# EAGLE design force_meter_RevB (EAGLE 7.2.0)
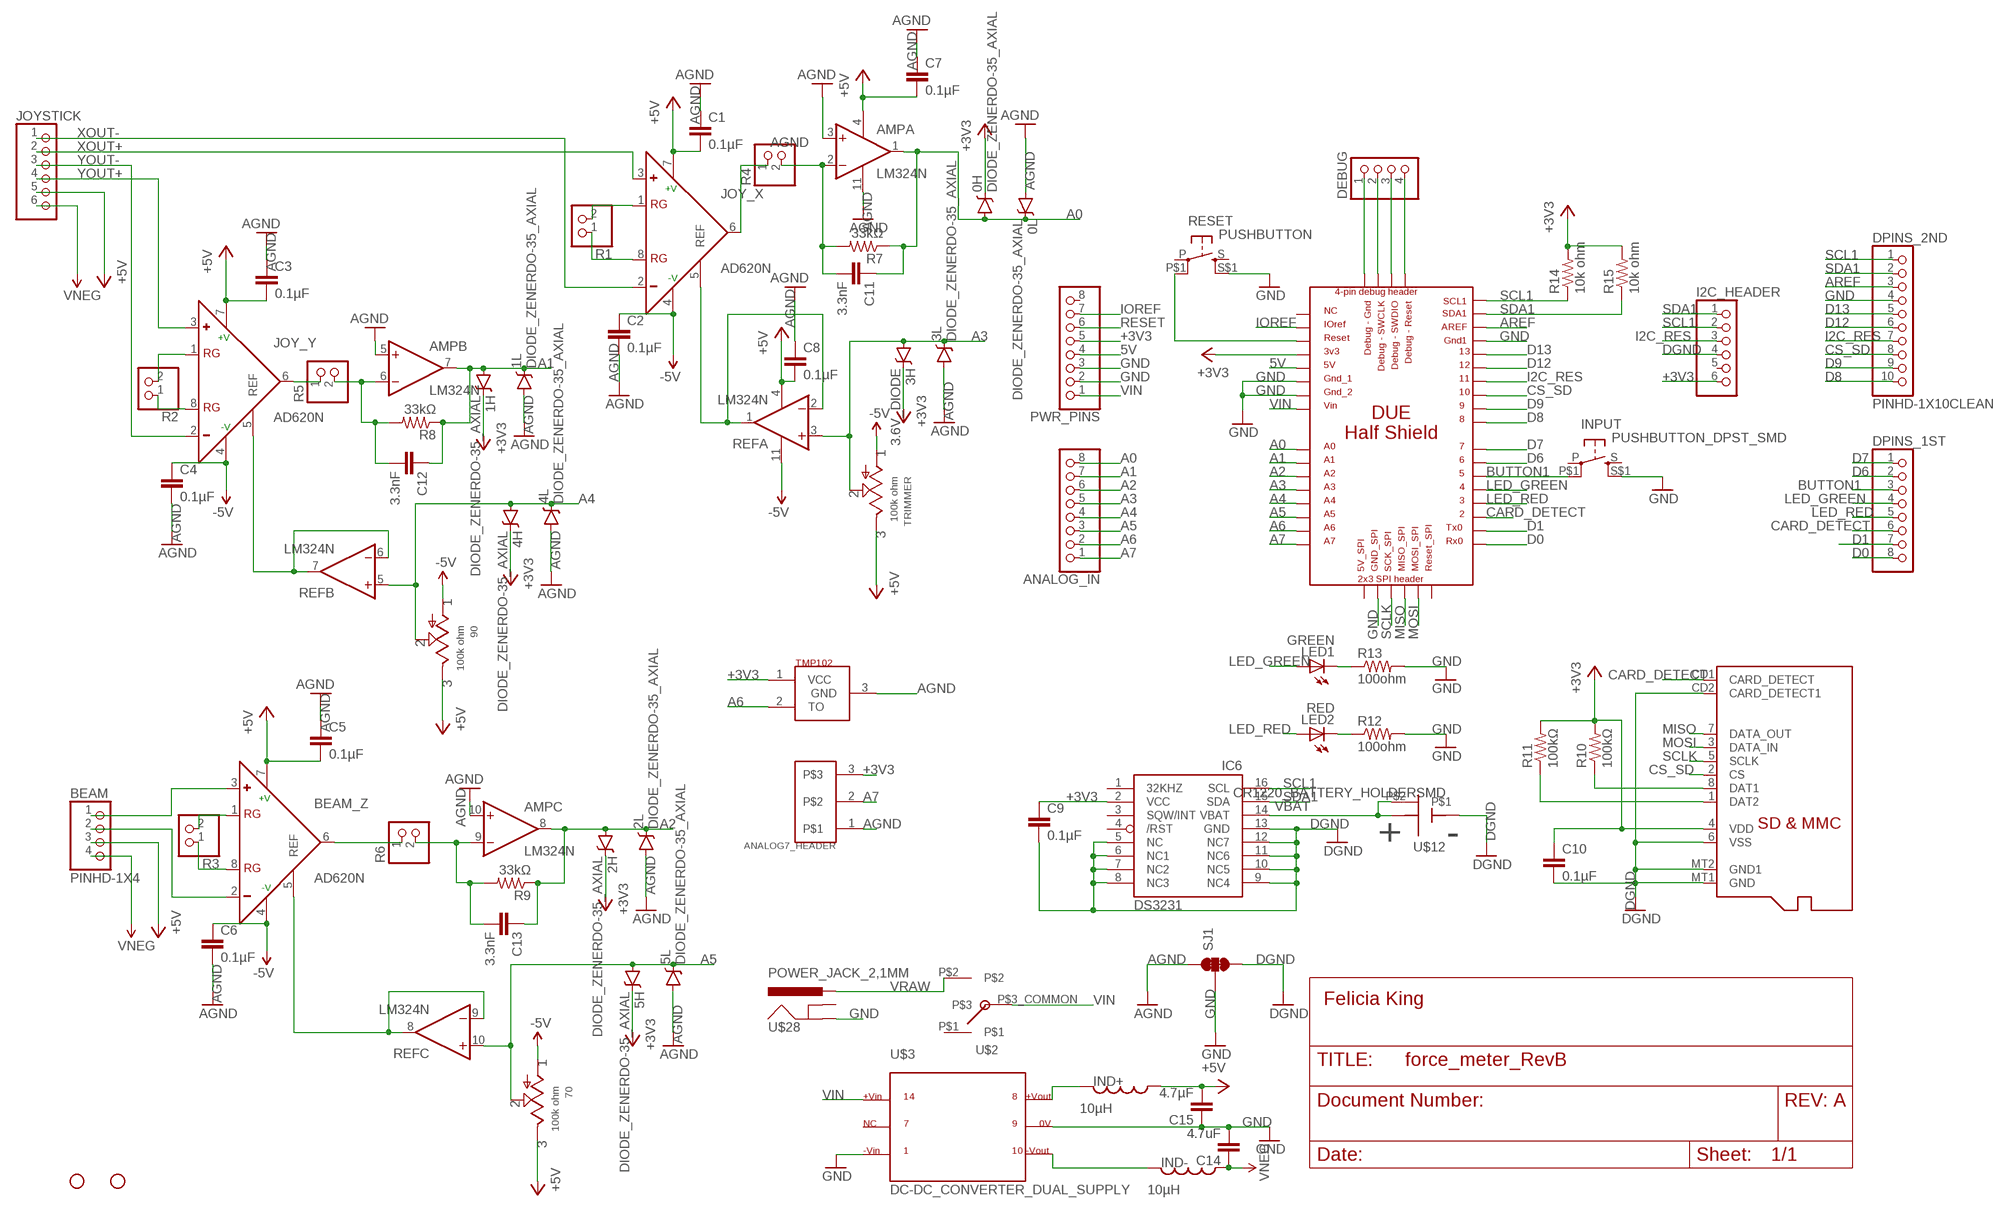
[diagram p0: schematic, sheet 1]

## Parts
0H  DIODE_ZENERDO-35_AXIAL  [DO35-7]
0L  DIODE_ZENERDO-35_AXIAL  [DO35-7]
1H  DIODE_ZENERDO-35_AXIAL  [DO35-7]
1L  DIODE_ZENERDO-35_AXIAL  [DO35-7]
2H  DIODE_ZENERDO-35_AXIAL  [DO35-7]
2L  DIODE_ZENERDO-35_AXIAL  [DO35-7]
3H  3.6V_DIODE  DIODE_ZENERDO-35_AXIAL  [DO35-7]
3L  DIODE_ZENERDO-35_AXIAL  [DO35-7]
4H  DIODE_ZENERDO-35_AXIAL  [DO35-7]
4L  DIODE_ZENERDO-35_AXIAL  [DO35-7]
5H  DIODE_ZENERDO-35_AXIAL  [DO35-7]
5L  DIODE_ZENERDO-35_AXIAL  [DO35-7]
70  100k ohm  TRIMMER_POTENTIOMETER_TT_ELEC67W  [R-TRIMMER_67W_TT_ELEC]
90  100k ohm  TRIMMER_POTENTIOMETER_TT_ELEC67W  [R-TRIMMER_67W_TT_ELEC]
AMP  LM324N  [DIL14]
ANALOG7_HEADER  PINHD-1X3  [1X03]
ANALOG_IN  PINHD-1X8CLEANBIG  [1X08-CLEANBIG]
BEAM  PINHD-1X4  PINHD-1X4LOCK  [1X04_LOCK]
BEAM_Z  AD620N  [DIL08]
C1  0.1µF  CAP0805  [0805]
C2  0.1µF  CAP0805  [0805]
C3  0.1µF  CAP0805  [0805]
C4  0.1µF  CAP0805  [0805]
C5  0.1µF  CAP0805  [0805]
C6  0.1µF  CAP0805  [0805]
C7  0.1µF  CAP0805  [0805]
C8  0.1µF  CAP0805  [0805]
C9  0.1µF  CAP0805  [0805]
C10  0.1µF  CAP0805  [0805]
C11  3.3nF  CAP0805  [0805]
C12  3.3nF  CAP0805  [0805]
C13  3.3nF  CAP0805  [0805]
C14  4.7uF  CAP0805  [0805]
C15  4.7µF  CAP0805  [0805]
DEBUG  PINHD-1X4LOCK  [1X04_LOCK]
DPINS_1ST  PINHD-1X8CLEANBIG  [1X08-CLEANBIG]
DPINS_2ND  PINHD-1X10CLEAN  [1X10-CLEANBIG]
I2C_HEADER  PINHD-1X6LOCK  [1X06-LOCK]
IC6  DS3231/SO  [SO16W]
IND+  10µH  INDUCTOR0805_TY  [I_0805]
IND-  10µH  INDUCTOR0805_TY  [I_0805]
INPUT  PUSHBUTTON_DPST_SMD  [PUSHBUTTON_DPST_SMD]
JOY_X  AD620N  [DIL08]
JOY_Y  AD620N  [DIL08]
JOYSTICK  PINHD-1X6LOCK  [1X06-LOCK]
LED1  GREEN  LED  [CHIPLED_0805]
LED2  RED  LED  [CHIPLED_0805]
PWR_PINS  PINHD-1X8CLEANBIG  [1X08-CLEANBIG]
R1  PINHD-1X2  [1X02]
R2  PINHD-1X2  [1X02]
R3  PINHD-1X2  [1X02]
R4  PINHD-1X2  [1X02]
R5  PINHD-1X2  [1X02]
R6  PINHD-1X2  [1X02]
R7  33kΩ  RESISTOR_SMDR0805  [R0805]
R8  33kΩ  RESISTOR_SMDR0805  [R0805]
R9  33kΩ  RESISTOR_SMDR0805  [R0805]
R10  100kΩ  RESISTOR_SMDR0805  [R0805]
R11  100kΩ  RESISTOR_SMDR0805  [R0805]
R12  100ohm  RESISTOR_SMDR0805  [R0805]
R13  100ohm  RESISTOR_SMDR0805  [R0805]
R14  10k ohm  RESISTOR_SMDR0805  [R0805]
R15  10k ohm  RESISTOR_SMDR0805  [R0805]
REF  LM324N  [DIL14]
RESET  PUSHBUTTON  PUSHBUTTON_DPST_SMD  [PUSHBUTTON_DPST_SMD]
SJ1  JUMPER-PAD-3-NC_BY_TRACE  [PAD-JUMPER-3-3OF3_NC_BY_TRACE_YES_SILK_FULL_BOX]
STANDOFF1  STAND-OFF  [STAND-OFF]
STANDOFF2  STAND-OFF  [STAND-OFF]
TMP102  LM62  [SOT23]
TRIMMER  100k ohm  TRIMMER_POTENTIOMETER_TT_ELEC67W  [R-TRIMMER_67W_TT_ELEC]
U$1  DUE_HALF_SHIELD_A7-ANALOG  [DUE_HALF_SHIELD_A7-ANALOG]
U$2  SWITCH_SLIDE_SMD_SPDT  [SWITCH_SMD_RA_SPDT]
U$3  DC-DC_CONVERTER_DUAL_SUPPLY  [DCDC_CONVERTOR-MEV1D]
U$11  MICROSD  [MICROSD]
U$12  CR1220_BATTERY_HOLDERSMD  [CR1220_BATTERY_HOLDER_SMD]
U$28  POWER_JACK_2,1MM  [POWER_JACK_DC_2,1MM]

## Nets
5V: PWR_PINS.4 U$1.5V1(5V)
+3V3: 0H.C 1H.C 2H.C 3H.C 4H.C 5H.C ANALOG7_HEADER.3 C9.1 C10.1 I2C_HEADER.6 IC6.2(VCC) PWR_PINS.5 R10.2 R11.2 R14.2 R15.2 TMP102.1(VCC) U$1.3V3 U$11.4(VDD)
+5V: 70.P$3 90.P$3 AMP.4(P:V+) BEAM.3 BEAM_Z.7(+V) C1.2 C3.2 C5.2 C7.2 C8.2 C15.2 IND+.P$1 JOY_X.7(+V) JOY_Y.7(+V) JOYSTICK.5 REF.4(P:V+) TRIMMER.P$3
-5V: 70.P$1 90.P$1 BEAM.4 BEAM_Z.4(-V) C6.1 C14.1 IND-.P$1 JOYSTICK.6 TRIMMER.P$1 ; supply symbol labelled VNEG
A0: 0H.A 0L.C AMP.1(A:OUT) ANALOG_IN.8 C11.1 R7.1 U$1.A0
A1: 1H.A 1L.C AMP.7(B:OUT) ANALOG_IN.7 C12.1 R8.1 U$1.A1
A2: 2H.A 2L.C AMP.8(C:OUT) ANALOG_IN.6 C13.1 R9.1 U$1.A2
A3: 3H.A 3L.C ANALOG_IN.5 REF.3(A:+IN) TRIMMER.P$2 U$1.A3
A4: 4H.A 4L.C 90.P$2 ANALOG_IN.4 REF.5(B:+IN) U$1.A4
A5: 5H.A 5L.C 70.P$2 ANALOG_IN.3 REF.10(C:+IN) U$1.A5
A6: ANALOG_IN.2 TMP102.2(TO) U$1.A6
A7: ANALOG7_HEADER.2 ANALOG_IN.1 U$1.A7
AGND: 0L.A 1L.A 2L.A 3L.A 4L.A 5L.A AMP.3(A:+IN) AMP.5(B:+IN) AMP.10(C:+IN) AMP.11(P:V-) ANALOG7_HEADER.1 C1.1 C2.2 C3.1 C4.2 C5.1 C6.2 C7.1 C8.1 SJ1.1 TMP102.3(GND)
AREF: DPINS_2ND.3 U$1.AREF
BUTTON1: DPINS_1ST.3 INPUT.P$1(P1) U$1.5
CARD_DETECT: DPINS_1ST.6 U$1.2 U$11.CD1(CARD_DETECT)
CS_SD: DPINS_2ND.8 U$1.10 U$11.2(CS)
D0: DPINS_1ST.8 U$1.RX0
D1: DPINS_1ST.7 U$1.TX0
D6: DPINS_1ST.2 U$1.6
D7: DPINS_1ST.1 U$1.7
D8: DPINS_2ND.10 U$1.8
D9: DPINS_2ND.9 U$1.9
D12: DPINS_2ND.6 U$1.12
D13: DPINS_2ND.5 U$1.13
DGND: C9.2 C10.2 I2C_HEADER.4 IC6.5(NC) IC6.6(NC1) IC6.7(NC2) IC6.8(NC3) IC6.9(NC4) IC6.10(NC5) IC6.11(NC6) IC6.12(NC7) IC6.13(GND) SJ1.3 U$11.6(VSS) U$11.CD2(CARD_DETECT1) U$11.MT1(GND) U$11.MT2(GND1) U$12.GND
GND: C14.2 C15.1 DPINS_2ND.4 INPUT.S$1(S1) PWR_PINS.2 PWR_PINS.3 R12.2 R13.2 RESET.S$1(S1) SJ1.2 U$1.GND1 U$1.GND_1 U$1.GND_2 U$1.GND_SPI U$3.P$1_-VIN U$3.P$9_0V U$28.P$2(GND)
I2C_RES: DPINS_2ND.7 I2C_HEADER.3 U$1.11
IOREF: PWR_PINS.7 U$1.IOREF1(IOREF)
LED_GREEN: DPINS_1ST.4 LED1.A U$1.4
LED_RED: DPINS_1ST.5 LED2.A U$1.3
MISO: U$1.MISO_SPI U$11.7(DATA_OUT)
MOSI: U$1.MOSI_SPI U$11.3(DATA_IN)
N$2: JOY_Y.1(RG) R2.2
N$3: JOY_X.6(OUT) R4.1
N$4: BEAM_Z.6(OUT) R6.1
N$5: JOY_X.1(RG) R1.2
N$6: JOY_X.8(RG) R1.1
N$7: JOY_Y.8(RG) R2.1
N$8: JOY_Y.6(OUT) R5.1
N$9: BEAM_Z.1(RG) R3.2
N$10: BEAM_Z.8(RG) R3.1
N$11: AMP.2(A:-IN) C11.2 R4.2 R7.2
N$21: AMP.6(B:-IN) C12.2 R5.2 R8.2
N$25: AMP.9(C:-IN) C13.2 R6.2 R9.2
N$28: IND-.P$2 U$3.P$10_-VOUT
N$29: IND+.P$2 U$3.P$8_VOUT
N$30: R10.1 U$11.8(DAT1)
N$31: BEAM.2 BEAM_Z.2(-)
N$32: BEAM.1 BEAM_Z.3(+)
N$33: R11.1 U$11.1(DAT2)
N$35: DEBUG.1 U$1.GND_DEBUG
N$36: LED1.C R13.1
N$37: LED2.C R12.1
N$38: DEBUG.2 U$1.SWCLK_DEBUG
N$39: DEBUG.3 U$1.SWDIO_DEBUG
N$40: DEBUG.4 U$1.RESET_DEBUG
REF_BEAM: BEAM_Z.5(REF) REF.8(C:OUT) REF.9(C:-IN)
REF_JOYX: JOY_Y.5(REF) REF.6(B:-IN) REF.7(B:OUT)
REF_JOYY: JOY_X.5(REF) REF.1(A:OUT) REF.2(A:-IN)
RESET: PWR_PINS.6 RESET.P$1(P1) U$1.RESET
SCL1: DPINS_2ND.1 I2C_HEADER.2 IC6.16(SCL) R14.1 U$1.SCL1
SCLK: U$1.SCK_SPI U$11.5(SCLK)
SDA1: DPINS_2ND.2 I2C_HEADER.1 IC6.15(SDA) R15.1 U$1.SDA1
VBAT: IC6.14(VBAT) U$12.P$1(VBAT) U$12.P$2
VIN: PWR_PINS.1 U$1.VIN1(VIN) U$2.P$3_COMMON U$3.P$14_VIN
VNEG: C2.1 C4.1 JOY_X.4(-V) JOY_Y.4(-V) REF.11(P:V-) ; supply symbol labelled -5V
VRAW: U$2.P$2 U$28.P$1(PWR)
XOUT+: JOY_X.3(+) JOYSTICK.2
XOUT-: JOY_X.2(-) JOYSTICK.1
YOUT+: JOY_Y.3(+) JOYSTICK.4
YOUT-: JOY_Y.2(-) JOYSTICK.3
Unconnected: AMP.12(D:+IN) AMP.13(D:-IN) AMP.14(D:OUT) I2C_HEADER.5 IC6.1(32KHZ) IC6.3(SQW/INT) IC6.4(/RST) INPUT.P INPUT.S PWR_PINS.8 REF.12(D:+IN) REF.13(D:-IN) REF.14(D:OUT) RESET.P RESET.S U$1.5V_SPI U$1.NC1(NC) U$1.RESET_SPI U$2.P$1 U$3.P$7_NC U$28.P$3(GNDBREAK)

## Library data of the parts
0H 0L 1H 1L 2H 2L 3H 3L 4H 4L 5H 5L = Felicia_force_logger:DIODE_ZENER: Zener Diode Example: NXP Semiconductors PN NZX3V6C,133 Digikey PN 568-7963-1-ND
70 90 = miller:TRIMMER_POTENTIOMETER_TT_ELEC: Trimmer potentiometer (variable resistor) TT Electronics Series 67 http://www.bitechnologies.com/pdfs/67.pdf
AMP REF = Felicia_force_logger:LM324: OP AMP LM324 quad op amp Digikey PN 296-1391-5-ND 14-PDIP
ANALOG7_HEADER = Felicia_force_logger:PINHD-1X3: 1x3 pin header, 0.1" spacing (2.54mm)
ANALOG_IN DPINS_1ST PWR_PINS = Felicia_force_logger:PINHD-1X8: PIN HEADER "BIG" packages have 0.04" drill holes and 0.07" pad widths Regular packages should have 0.035" drills with 0.066" pad widths.
BEAM DEBUG = Felicia_force_logger:PINHD-1X4: 1x4 0.1" space header Holes are slightly staggered to help hold pins in place when soldering.
BEAM_Z JOY_X JOY_Y = Felicia_force_logger:AD620: Low Cost, Low Power, Instrumentation Amplifier Source: http://www.analog.com/UploadedFiles/Data_Sheets/37793330023930AD620_e.pdf Digikey PN AD620ANZ-ND or similar 8-DIP Digikey PN AD620ARZ-ND 8-SOIC surface mount; MF: ALTERA CORPORATION; MPN: AD620AN; OC_FARNELL: 1523782; OC_NEWARK: 05F7108
C1-C15 = Felicia_force_logger:CAP: Capacitor Standard ceramic capacitor, surface mount or 0.1" leaded capacitor.
DPINS_2ND = Felicia_force_logger:PINHD-1X10: Pin header 1x10 0.1" spacing With round pins
I2C_HEADER JOYSTICK = Felicia_force_logger:PINHD-1X6: PIN HEADER "BIG" packages have 0.04" drills appropriate for larger terminal blocks, otherwise drills are 0.035".
IC6 = Felicia_force_logger:DS3231: DS3231 Real Time Clock, I2C. Temperature-compensated crystal oscillator 16SOIC-WIDE Digikey PN DS3231SN#T&RCT-ND
IND+ IND- = Felicia_force_logger:INDUCTOR: Inductor Example: Taiyo Yuden PN LBR2012T100K
INPUT RESET = Felicia_force_logger:PUSHBUTTON_DPST_SMD: PUSHBUTTON DPST SMD Omron B3S-1000 Digikey PN SW836CT-ND
LED1 LED2 = Felicia_force_logger:LED: LEDs Standard schematic elements and footprints for 5mm, 3mm, 1206, and 0603 sized LEDs. 5mm - Spark Fun Electronics SKU : COM-00529 (and others)
R1-R6 = Felicia_force_logger:PINHD-1X2: 1x2 pin header 0.1" spacing (2.54mm)
R7-R15 = Felicia_force_logger:RESISTOR_SMD: RESISTOR, American symbol
SJ1 = Felicia_force_logger:JUMPER-PAD-3-NC_BY_TRACE
STANDOFF1 STANDOFF2 = miller:STAND-OFF: #4 Stand Off This is the mechanical footprint for a #4 phillips button head screw. Use the keepout ring to avoid running the screw head into surrounding components. SKU : PRT-00447
TMP102 = Felicia_force_logger:LM62: LM62 Analog temperature sensor SOT-23 package 480mV offset at 0C, 15.6mV/C output 2.7 to 10V supply.
TRIMMER = Felicia_force_logger:TRIMMER_POTENTIOMETER_TT_ELEC: Trimmer potentiometer (variable resistor) TT Electronics Series 67 http://www.bitechnologies.com/pdfs/67.pdf
U$1 = Felicia_force_logger:DUE_HALF_SHIELD_A7-ANALOG: Arduino Due shield Matches Uno R3 footprint, but adds Due SPI 2x3 header, debug wire 4-pin header, and adds Analog pins A6 and A7. **NOTE**The 5V pin on the Due SPI 2x3 header outputs 5V, rather than the 3V3 you might expect.
U$2 = Felicia_force_logger:SWITCH_SLIDE_SMD_SPDT: Single Pole Dual Throw switch Copal PN CSS-1210TB (surface mount, right-angle) Digikey PN 563-1091-1-ND
U$3 = Felicia_force_logger:DC-DC_CONVERTER_DUAL_SUPPLY: Murata DC-DC converter dual-supply Example: Murata PN: MEV1D1205 Digikey PN: 811-2272-ND
U$11 = Felicia_force_logger:MICROSD: Micro-SD / Transflash card holder with SPI pinout For the 3M # 2908-05WB-MG and/or 4UCON #19656 push-push type Digikey PN 3M5607CT-ND
U$12 = Felicia_force_logger:CR1220_BATTERY_HOLDER: CR1220 Battery Holder Keystone Part # 3001 Digikey 3001K-ND
U$28 = Felicia_force_logger:POWER_JACK_2,1MM: DC Power Jack, 2.1mm center pin. Digikey PN CP-202AH-ND

## Board
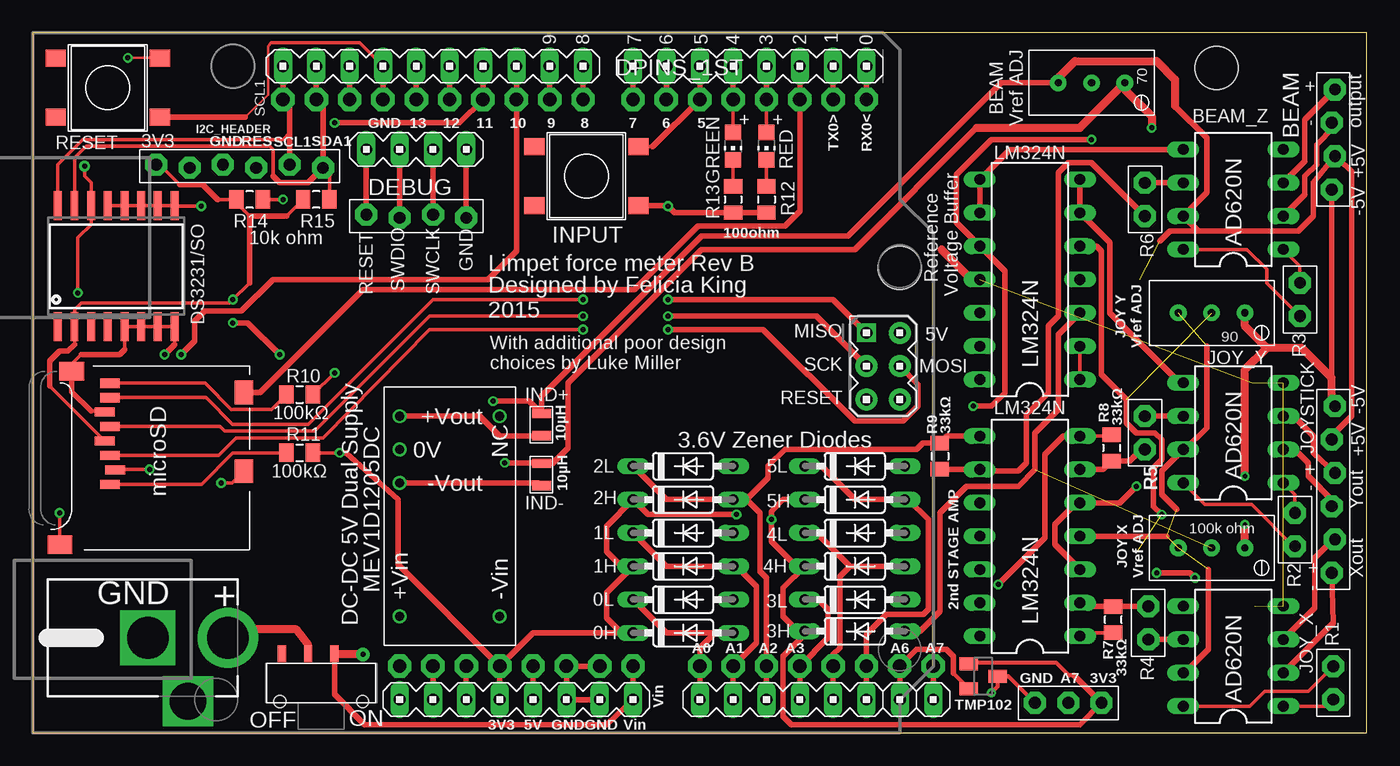
[diagram p1: board, top side]
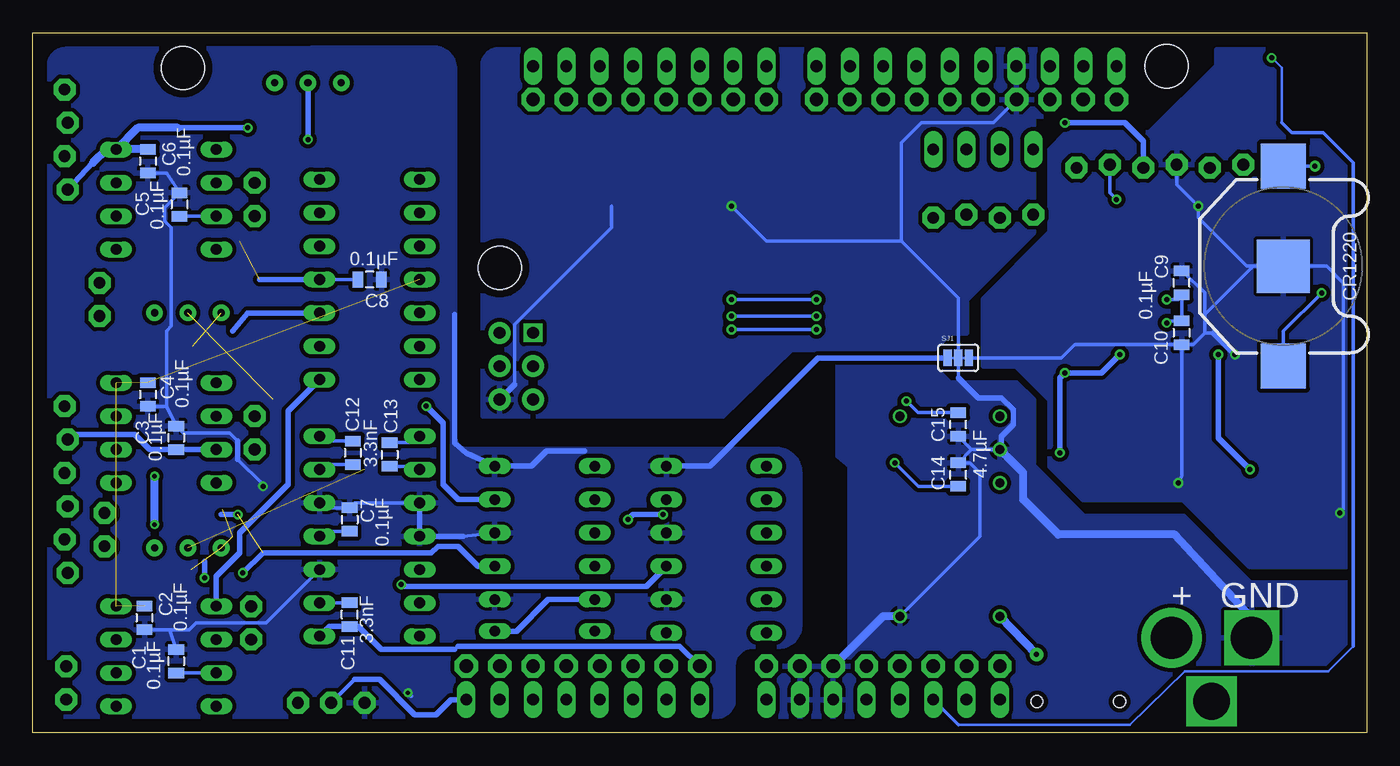
[diagram p2: board, bottom side, seen from below]

Size 101.6 x 53.34 mm. Coordinates in mm from the lower left corner, seen from the top.
Outline: 0,0 101.6,0 101.6,53.34 0,53.34 0,0
Copper layers (1*16): Top 0.0356mm / dielectric 1.5011mm / Bottom 0.0356mm
Design rules "LaenPCBOrder *": minimum track width 6mil, minimum drill 13mil, track to track 6mil, track to pad 6mil, pad to pad 6mil, via to via 6mil, smd to smd 6mil, copper to edge 15mil, drill to drill 6mil, minimum pad ring 7mil, minimum via ring 7mil, stop-mask expansion 3mil, vias tented up to drill 30mil, thermal gap 10mil

### Footprints (pad centres in the part's own frame; a part is rotated, then mirrored left to right if it is on the bottom)
DO35-7 = drill 0.813 long: A 3.81,0; C -3.81,0
R-TRIMMER_67W_TT_ELEC = drill 0.541 pad 1.27: P$1 -2.54,0; P$2 0,0; P$3 2.54,0
DIL14 = drill 0.813 long: 1 -7.62,-3.81; 2 -5.08,-3.81; 3 -2.54,-3.81; 4 0,-3.81; 5 2.54,-3.81; 6 5.08,-3.81; 7 7.62,-3.81; 8 7.62,3.81; 9 5.08,3.81; 10 2.54,3.81; 11 0,3.81; 12 -2.54,3.81; 13 -5.08,3.81; 14 -7.62,3.81
1X03 = drill 0.9 pad 1.676 octagon: 1 -2.54,0; 2 0,0; 3 2.54,0
1X08-CLEANBIG = drill 1.016 pad 1.778 octagon: 1 -8.89,0; 2 -6.35,0; 3 -3.81,0; 4 -1.27,0; 5 1.27,0; 6 3.81,0; 7 6.35,0; 8 8.89,0
1X04_LOCK = drill 0.9 pad 1.676 octagon: 1 -3.81,0.127; 2 -1.27,-0.127; 3 1.27,0.127; 4 3.81,-0.127
DIL08 = drill 0.813 long: 1 -3.81,-3.81; 2 -1.27,-3.81; 3 1.27,-3.81; 4 3.81,-3.81; 5 3.81,3.81; 6 1.27,3.81; 7 -1.27,3.81; 8 -3.81,3.81
0805 = smd 0.8 x 1.2: 1 -0.9,0; 2 0.9,0
1X10-CLEANBIG = drill 1.016 pad 1.778 octagon: 1 -11.43,0; 2 -8.89,0; 3 -6.35,0; 4 -3.81,0; 5 -1.27,0; 6 1.27,0; 7 3.81,0; 8 6.35,0; 9 8.89,0; 10 11.43,0
1X06-LOCK = drill 0.9 pad 1.676 octagon: 1 -6.35,0.127; 2 -3.81,-0.127; 3 -1.27,0.127; 4 1.27,-0.127; 5 3.81,0.127; 6 6.35,-0.127
SO16W = smd 0.6 x 2.2: 1 -4.445,-4.6; 2 -3.175,-4.6; 3 -1.905,-4.6; 4 -0.635,-4.6; 5 0.635,-4.6; 6 1.905,-4.6; 7 3.175,-4.6; 8 4.445,-4.6; 9 4.445,4.6; 10 3.175,4.6; 11 1.905,4.6; 12 0.635,4.6; 13 -0.635,4.6; 14 -1.905,4.6; 15 -3.175,4.6; 16 -4.445,4.6
I_0805 = smd 0.7 x 1.45: P$1 -0.85,0; P$2 0.85,0
PUSHBUTTON_DPST_SMD = smd 1.55 x 1.3: P 3.975,-2.25; P$1 -3.975,-2.25; S 3.975,2.25; S$1 -3.975,2.25
CHIPLED_0805 = smd 1.2 x 1.2: A 0,-1.05; C 0,1.05
1X02 = drill 0.9 pad 1.676 octagon: 1 -1.27,0; 2 1.27,0
R0805 = smd 1.1 x 1.4: 1 -1,0; 2 1,0
PAD-JUMPER-3-3OF3_NC_BY_TRACE_YES_SILK_FULL_BOX = smd 0.635 x 1.27: 1 -0.813,0; 2 0,0; 3 0.813,0
STAND-OFF = hole 3.302: 0,0
SOT23 = smd 1 x 1.4: 1 -0.95,-1.1; 2 0.95,-1.1; 3 0,1.1
DUE_HALF_SHIELD_A7-ANALOG = drill 0.9 pad 1.422 long: 2 58.42,50.8; 3 55.88,50.8; 3V3 35.56,2.54; 4 53.34,50.8; 5 50.8,50.8; 5V1 38.1,2.54; 6 48.26,50.8; 7 45.72,50.8; 8 41.91,50.8; 9 39.37,50.8; 10 36.83,50.8; 11 34.29,50.8; 12 31.75,50.8; 13 29.21,50.8; A0 50.8,2.54; A1 53.34,2.54; A2 55.88,2.54; A3 58.42,2.54; A4 60.96,2.54; A5 63.5,2.54; A6 66.04,2.54; A7 68.58,2.54; AREF 24.13,50.8; GND1 26.67,50.8; GND_1 40.64,2.54; GND_2 43.18,2.54; GND_DEBUG 33.02,44.45; IOREF1 30.48,2.54; NC1 27.94,2.54; RESET 33.02,2.54; RESET_DEBUG 25.4,44.45; RX0 63.5,50.8; SCL1 19.05,50.8; SDA1 21.59,50.8; SWCLK_DEBUG 30.48,44.45; SWDIO_DEBUG 27.94,44.45; TX0 60.96,50.8; VIN1 45.72,2.54 | drill 0.9 pad 1.676: 5V_SPI 66.04,30.48; GND_SPI 66.04,25.4; MOSI_SPI 66.04,27.94; RESET_SPI 63.5,25.4; SCK_SPI 63.5,27.94 | drill 0.9 pad 1.422 square: MISO_SPI 63.5,30.48
SWITCH_SMD_RA_SPDT = smd 0.635 x 1.27: P$1 -3,3.75; P$2 -1,3.75; P$3_COMMON 1,3.75 | hole 0.9: -3.15,0.1; 3.15,0.1
DCDC_CONVERTOR-MEV1D = drill 0.7: P$1_-VIN -7.62,-3.81; P$7_NC 7.62,-3.81; P$8_VOUT 7.62,3.81; P$9_0V 5.08,3.81; P$10_-VOUT 2.54,3.81; P$14_VIN -7.62,3.81
MICROSD = smd 0.7 x 1.5: 1 9,-10.64; 2 7.9,-10.24; 3 6.8,-10.64; 4 5.7,-11.04; 5 4.6,-10.64; 6 3.5,-11.04; 7 2.4,-10.64; 8 1.3,-10.64 | smd 1.8 x 1.4: CD1 2,-0.44; CD2 8,-0.44 | smd 1.4 x 1.9: MT1 0.4,-13.54; MT2 13.6,-14.44
CR1220_BATTERY_HOLDER_SMD = smd 4.064 x 4.064: GND 0,0 | smd 3.429 x 3.429: P$1 -7.62,0; P$2 7.62,0
POWER_JACK_DC_2,1MM = drill 3.175 pad 4.572: P$1 0,0 | drill 3.175 square: P$2 6.096,0 | drill 2.8 square: P$3 3.048,4.826

### Placement (x,y rotation side)
0H  49.53,7.62 0 top
0L  49.53,10.16 0 top
1H  49.53,12.7 0 top
1L  49.53,15.24 0 top
2H  49.53,17.78 0 top
2L  49.53,20.32 0 top
3H  62.61,7.75 0 top
3L  62.61,10.16 0 top
4H  62.61,12.7 0 top
4L  62.61,15.24 0 top
5H  62.61,17.78 0 top
5L  62.61,20.32 0 top
70  80.64,49.53 180 top
90  89.79,32 180 top
AMP  75.95,14.99 90 top
ANALOG7_HEADER  78.87,2.29 0 top
ANALOG_IN  59.69,5.08 180 top
BEAM  99.06,45.21 270 top
BEAM_Z  91.44,40.64 90 top
C1  90.68,5.46 270 bottom
C2  93.09,8.76 270 bottom
C3  90.68,22.48 270 bottom
C4  92.84,25.78 270 bottom
C5  90.42,40.26 270 bottom
C6  92.84,43.56 270 bottom
C7  77.47,16.26 270 bottom
C8  75.95,34.54 180 bottom
C9  14.1,34.29 90 bottom
C10  14.1,30.48 270 bottom
C11  77.47,9.02 90 bottom
C12  77.22,21.34 270 bottom
C13  74.42,21.21 270 bottom
C14  31.11,19.68 90 bottom
C15  31.11,23.5 90 bottom
DEBUG  29.21,39.37 180 top
DPINS_1ST  54.61,48.26 0 top
DPINS_2ND  30.48,48.26 0 top
I2C_HEADER  15.75,43.18 180 top
IC6  6.35,35.56 0 top
IND+  38.73,23.5 270 top
IND-  38.73,19.68 270 top
INPUT  42.16,42.42 180 top
JOY_X  91.44,5.84 90 top
JOY_Y  91.44,22.86 90 top
JOYSTICK  99.06,18.54 90 top
LED1  53.34,44.7 180 top
LED2  55.88,44.7 180 top
PWR_PINS  36.83,5.08 180 top
R1  99.06,3.81 270 top
R2  96.14,15.49 90 top
R3  96.52,33.02 90 top
R4  84.96,8.38 90 top
R5  84.71,22.86 270 top
R6  84.71,40.64 270 top
R7  82.3,8.64 90 top
R8  82.17,21.72 270 top
R9  69.09,21.08 270 top
R10  20.32,25.78 0 top
R11  20.32,21.34 0 top
R12  55.88,40.64 270 top
R13  53.34,40.64 270 top
R14  16.51,40.64 180 top
R15  21.59,40.64 180 top
REF  75.95,34.54 90 top
RESET  5.71,49.15 180 top
SJ1  31.11,28.57 0 bottom
STANDOFF1  15.24,50.8 0 top
STANDOFF2  66.04,35.43 0 top
STANDOFF3  STAND-OFF  [STAND-OFF]  90.17,50.67 0 top
TMP102  72.39,4.32 270 top
TRIMMER  89.79,14.1 180 top
U$1  0,0 0 top
U$2  21.97,2.29 0 top
U$3  31.75,16.51 90 top
U$11  16.51,27.94 270 top
U$12  6.35,35.56 270 bottom
U$28  14.86,7.24 180 top

### Tracks (layer width: path | path; a pad name or v marks a point on that pad's centre or on a via)
5V
  Top 0.406: U$1.5V1 PWR_PINS.4
+3V3  (via drill 0.38, 0.38 pad 0.3)
  Top 0.254: R15.2 19.32,39.37 | 16.51,39.37 15.51,40.37 R14.2 14.1,40.64 | 16.51,34.29 v15.24,33.02 14.99,32.77 3.68,32.77 3.17,32.26 IC6.2 3.17,29.59 | 1.27,26.44 U$11.4 | v56.26,16.26 56.26,16.38 | R11.2 v23.37,21.34 | v22.99,27.43 R10.2 | I2C_HEADER.6 9.65,43.31 11.18,41.78
  Top 0.305: 79.31,4.38 78.93,4.38 77.98,5.33 71.36,5.33 TMP102.1
  Top 0.406: U$1.3V3 PWR_PINS.5 | 19.32,39.37 16.51,39.37 16.51,34.29 | 3.17,29.59 2.67,29.08 2.03,29.08 1.27,28.32 1.27,26.44 | PWR_PINS.5 38.1,7.62 0H.C 44.83,7.62 43.69,8.76 43.69,10.67 1H.C 44.83,12.7 43.69,13.84 43.69,15.75 2H.C 46.86,16.64 v53.59,16.64 | v23.37,21.34 23.88,21.34 27.81,17.78 27.81,12.83 PWR_PINS.5 | v15.24,31.24 16.38,31.24 v18.8,28.83 | 11.18,41.78 12.95,41.78 14.1,40.64 | 79.31,4.38 ANALOG7_HEADER.3 79.76,0.64 57.78,0.64 57.15,1.27 57.15,5.84 58.93,7.62 3H.C 58.29,7.75 57.15,8.89 57.15,11.05 4H.C 58.17,12.7 56.26,14.61 v56.26,16.26 | 56.26,16.38 56.26,16.89 57.15,17.78 5H.C
  Bottom 0.254: v15.24,33.02 14.34,33.02 C9.1 C10.1 15.1,31.38 v15.24,31.24
  Bottom 0.406: v53.59,16.64 55.88,16.64 v56.26,16.26 | v23.37,21.34 23.37,27.05 v22.99,27.43 20.19,27.43 v18.8,28.83
+5V  (via drill 0.38 pad 0.3)  (5 unrouted)
  Top 0.254: JOY_Y.7 87.76,21.59 | JOYSTICK.5 99.06,22.73
  Top 0.406: v35.05,25.27 37.81,25.27 IND+.P$1 38.73,25.65 50.93,37.85 62.1,37.85 73.79,49.53 70.P$3 | 88.77,38.23 96.39,38.23 97.54,39.37 97.54,41.91 BEAM.3 100.46,42.8 100.46,24.13 99.06,22.73 | 88.77,38.23 BEAM_Z.7 89.41,41.15 89.41,45.34 87,47.75 | 88.77,38.23 86.61,38.23 85.85,37.47 | 87.76,21.59 89.41,23.24 89.41,29.46 | JOY_X.7 87.76,4.57 89.53,6.35 89.53,12.45 | 87.12,17.02 85.98,18.16 85.98,19.94 JOY_Y.7 | AMP.4 86.36,14.99
  Top 0.61: 70.P$3 78.11,49.91 79.38,51.18 85.6,51.18 87,49.78 87,47.75
  Bottom 0.254: C15.2 34.17,24.39 v35.05,25.27 | C1.2 87.64,4.56 JOY_X.7 | 89.91,21.59 C3.2 | BEAM_Z.7 89.91,39.37 C5.2 | C7.2 79.39,15.36 AMP.4 | REF.4 C8.2
  Bottom 0.406: JOY_Y.7 89.91,21.59 | C3.2 92.7,21.58 93.85,22.73 98.68,22.73 JOYSTICK.5 | REF.4 84.33,34.54
-5V  (via drill 0.33, 0.38, 0.38 pad 0.3)
  Top 0.254: 38.7,20.57 IND-.P$1 39.59,20.54
  Top 0.406: v35.94,20.57 38.7,20.57 | 39.59,20.54 40.77,21.72 40.77,26.67 50.93,36.83 62.61,36.83 71.88,46.1 | BEAM.4 98.93,25.15 JOYSTICK.6
  Top 0.61: 71.88,46.1 79.76,46.1 70.P$1 83.19,49.02 85.22,46.99 v85.22,46.1 | 98.93,25.15 98.93,27.05 96.65,29.34 93.98,29.34 | 93.98,29.34 92.33,30.99 90.P$1 | TRIMMER.P$1 v92.33,15.88 | v92.33,19.56 92.33,27.69 93.98,29.34
  Bottom 0.254: C14.1 34.15,18.79 v35.94,20.57
  Bottom 0.406: 97.03,43.43 BEAM.4 | v85.22,46.1 90.55,46.1
  Bottom 0.61: 90.55,46.1 93.6,46.1 BEAM_Z.4 | C6.1 BEAM_Z.4 | BEAM_Z.4 96.01,44.45 97.03,43.43 | v92.33,15.88 v92.33,19.56
A0
  Top 0.254: R7.1 80.03,7.64 AMP.1
  Top 0.406: U$1.A0 ANALOG_IN.8 50.8,6.48 51.94,7.62 | 0H.A 51.94,7.62 | 51.94,7.62 48.26,7.62 0L.C
  Bottom 0.254: C11.1 76.82,8.12 | 69.47,6.35 69.22,6.6
  Bottom 0.406: C11.1 79,8.12 AMP.1 | 76.82,8.12 75.06,6.35 69.47,6.35 | 69.22,6.6 52.32,6.6 ANALOG_IN.8
A1  (via drill 0.38)
  Top 0.254: AMP.7 82.06,22.61 R8.1
  Top 0.406: U$1.A1 ANALOG_IN.7 55.12,6.86 55.12,11.18 53.59,12.7 1H.A | 1H.A 48.26,12.7 1L.C | AMP.7 78.49,22.61 77.09,21.21 77.09,14.86 v73.53,11.3 | 52.07,12.7 1H.A
  Bottom 0.203: 73.41,11.18 v73.53,11.3
  Bottom 0.254: C12.1 79.39,22.24 AMP.7
  Bottom 0.406: 73.41,11.18 54.86,11.18 1H.A
A2
  Top 0.406: U$1.A2 ANALOG_IN.6 | ANALOG_IN.6 55.88,6.22 | 54.36,17.78 55.37,16.76 55.37,12.32 55.88,11.81 ANALOG_IN.6 | 54.36,17.78 2H.A 48.26,17.78 2L.C | 54.36,17.78 56.01,19.43 56.01,20.32 57.28,21.59 67.31,21.59 67.8,22.08 R9.1 69.61,22.61 AMP.8
  Bottom 0.254: C13.1 72.63,22.11 AMP.8
A3  (1 unrouted)
  Top 0.406: U$1.A3 ANALOG_IN.5 60.58,7.24 60.58,9.4 59.82,10.16 3L.C | REF.3 78.11,30.35 78.11,24.64 76.33,22.86 76.33,20.07 75.06,18.8 71.12,18.8 69.09,16.76 69.09,9.27 67.56,7.75 3H.A
  Bottom 0.406: REF.3 85.22,32 86.36,30.61 | 3L.C 62.36,10.16 64.77,7.75 3H.A
A4  (via drill 0.38)  (2 unrouted)
  Top 0.406: U$1.A4 ANALOG_IN.4 60.96,5.97 61.47,6.48 61.47,11.94 62.23,12.7 | v85.6,12.19 88.14,12.19 v88.52,11.81 | REF.5 81.03,37.08 81.41,36.7 81.41,27.3 83.31,25.4 83.31,23.62 84.07,22.86 85.47,22.86 85.98,22.35 85.98,20.83 85.34,20.19 85.34,17.27 v85.98,16.64 | 4L.C 59.69,15.24 62.23,12.7 | 62.23,12.7 4H.A
  Bottom 0.406: v85.6,12.19 84.07,13.72 71.25,13.72 70.74,14.22 69.22,14.22 67.69,12.7 4H.A | v88.52,11.81 88.52,13.08 | v85.98,16.64 87.25,16.64
A5  (via drill 0.38)
  Top 0.254: REF.10 72.14,36.7
  Top 0.406: U$1.A5 ANALOG_IN.3 63.5,7.49 65.02,9.02 67.82,9.02 68.2,9.4 68.2,16.26 66.67,17.78 5H.A 62.61,17.78 60.07,20.32 5L.C | v80.64,45.21 73.03,45.21 70.36,42.55 70.36,38.86 REF.10 74.04,35.18 74.04,25.91 73.03,24.89 v71.63,24.89
  Bottom 0.406: v80.64,45.21 70.P$2 | 5H.A 69.22,17.78 70.36,18.92 70.36,23.62 v71.63,24.89
A6
  Top 0.305: 70.1,4.55 TMP102.2
  Top 0.406: U$1.A6 ANALOG_IN.2 67.31,6.35 69.6,6.35 70.1,5.84 70.1,4.55
A7
  Top 0.406: U$1.A7 ANALOG_IN.1
  Bottom 0.305: 77.09,4.06 ANALOG7_HEADER.2
  Bottom 0.406: U$1.A7 69.72,2.54 70.87,1.4 72.52,1.4 75.18,4.06 77.09,4.06
AGND  (via drill 0.33 pad 0.69, 0.38)
  Top 0.254: AMP.5 79.5,17.53
  Top 0.305: ANALOG7_HEADER.1 74.3,4.32 TMP102.3 73.49,3.51 v73.03,3.05
  Top 0.406: 79.5,17.53 77.85,15.88 77.85,14.35 AMP.3 | AMP.5 82.8,17.53 v84.07,18.8
  Bottom 0.254: C2.2 91.16,7.86 | 91.16,7.86 C1.1 | C4.2 91.42,24.88 | 91.42,24.88 C3.1 90.16,22.86 86.61,22.86 85.98,22.23 | C6.2 91.42,42.66 C5.1 91.57,40.02 91.57,38.99 91.06,38.48 91.06,30.99 91.42,30.63 91.42,24.88 | AMP.5 79.39,17.16 C7.1 77.1,17.53 AMP.10 | 91.16,7.86 89.67,7.86 89.15,8.38 83.82,8.38 AMP.3 | 68.83,14.99 4L.A | v84.07,18.8 84.07,18.92 85.98,20.83
  Bottom 0.305: v73.03,3.05 72.77,2.79
  Bottom 0.406: 59.56,21.46 62.48,21.46 63.63,20.32 5L.A 68.58,21.34 69.47,22.1 69.47,31.88 | AMP.10 AMP.11 68.83,14.99 | 85.98,20.83 85.98,22.23 | 2L.A 50.04,20.32 41.78,28.57 SJ1.1
  pour Bottom (isolate 0.305): 69.47,22.48 69.47,50.53 arc-90 71.13,52.19 99.07,52.08 arc-90 100.33,50.81 100.33,2.54 arc-90 99.06,1.27 49.53,1.27 arc-90 48.26,2.54 48.26,5.08 arc90 46.86,6.6 44.85,6.6 arc-90 43.18,8.15 43.18,19.79 arc-90 44.98,21.59 68.58,21.59 arc90
AREF
  Top 0.406: U$1.AREF DPINS_2ND.3
BUTTON1
  Top 0.254: 50.71,48.17 DPINS_1ST.3 | INPUT.P$1 47.21,44.67
  Top 0.406: U$1.5 DPINS_1ST.3 47.21,44.67
CARD_DETECT
  Top 0.406: U$1.2 DPINS_1ST.6 58.42,39.75 57.28,38.61 50.67,38.61 45.85,33.78 25.15,33.78 17.3,25.94 U$11.CD1
CS_SD  (via drill 0.38)
  Top 0.254: v8.89,20.07 6.3,20.07 U$11.2
  Top 0.406: U$1.10 DPINS_2ND.8 36.83,36.7 34.67,34.54 18.29,34.54 15.88,32.13 13.08,32.13 12.32,31.37 12.32,29.84 v11.3,28.83
  Bottom 0.406: v11.3,28.83 11.3,22.48 v8.89,20.07
D0
  Top 0.406: U$1.RX0 DPINS_1ST.8
D1
  Top 0.406: U$1.TX0 DPINS_1ST.7
D6
  Top 0.406: U$1.6 DPINS_1ST.2
D7
  Top 0.406: U$1.7 DPINS_1ST.1
D8
  Top 0.406: U$1.8 DPINS_2ND.10
D9
  Top 0.406: U$1.9 DPINS_2ND.9
D12
  Top 0.406: U$1.12 DPINS_2ND.6
D13
  Top 0.406: U$1.13 DPINS_2ND.5
DGND  (via drill 0.38)
  Top 0.254: IC6.13 IC6.12 IC6.11 IC6.10 IC6.9 10.82,40.13 v12.83,40.13 | U$11.MT1 2.97,28.12 3.68,28.83 | 6.99,29.21 IC6.5 IC6.6 IC6.7 IC6.8 10.79,29.59 | 4.45,24.51 5.4,24.51 U$11.6 | v14.35,19.05 15.18,19.05 U$11.CD2 | v2.03,16.76 2.03,14.38 U$11.MT2
  Top 0.406: 3.68,28.83 6.6,28.83 6.99,29.21 | U$11.MT1 2.97,25.99 4.45,24.51 | 10.79,29.59 v10.03,28.83
  Bottom 0.254: C10.2 13.22,29.58 12.32,30.48 | 12.32,30.48 12.32,31.88 | 12.32,31.88 8.64,35.56 | 8.64,35.56 U$12.GND 3.05,35.56 1.78,34.29 1.78,17.02 v2.03,16.76 | 12.32,31.88 12.32,33.54 C9.2 | SJ1.3 23.24,28.57 22.23,29.59 13.98,29.59 C10.2 | C10.2 14.1,19.56 v14.35,19.05 | I2C_HEADER.4 14.48,41.78 v12.83,40.13 12.83,39.24 9.14,35.56 8.64,35.56 | 11.68,30.48 12.32,30.48
  Bottom 0.406: v10.03,28.83 11.68,30.48
  pour Bottom (isolate 0.305): 1.27,12.7 8.89,12.7 13.97,17.78 21.59,17.78 24.13,20.32 24.13,25.4 26.67,27.94 29.21,27.94 29.21,33.02 24.13,38.1 24.13,44.45 22.86,45.72 16.51,45.72 11.43,50.8 11.43,52.07 1.27,52.07
GND  (via drill 0.38)
  Top 0.203: 16.16,46.9 17.91,48.64 17.91,52.32 18.16,52.58
  Top 0.254: 18.16,52.58 24.89,52.58 U$1.GND1 | 55.9,39.62 R12.2 | 48.35,40.17 v48.39,40.13
  Top 0.406: U$1.GND_2 U$1.GND_1 PWR_PINS.3 PWR_PINS.2 | U$1.GND1 DPINS_2ND.4 | R12.2 R13.2 48.88,39.64 v48.39,40.13 | INPUT.S$1 48.35,40.17 | RESET.S$1 16.16,46.9
  Bottom 0.203: 27.82,21.71 U$3.P$9_0V
  Bottom 0.254: U$3.P$9_0V 30.11,21.59 | 30.11,21.59 C15.1 | 30.11,21.59 C14.2 30.24,20.59 29.46,19.81 29.46,14.99 U$3.P$1_-VIN | 35.43,37.47 31.11,33.15 SJ1.2 31.11,27.05 | 35.43,37.47 35.43,44.96 33.91,46.48 28.45,46.48 DPINS_2ND.4 | 35.43,37.47 45.72,37.47 v48.39,40.13 | 64.9,26.54 64.9,31.11 57.53,38.48 57.53,40.13
  Bottom 0.406: U$1.GND_SPI 64.9,26.54 | 31.11,27.05 29.59,25.53 27.81,25.53 26.92,24.64 26.92,23.5 27.82,22.59 27.82,21.71
  Bottom 0.61: U$3.P$1_-VIN 36.83,8.89 PWR_PINS.3 | 8.76,8.76 14.61,15.11 23.5,15.11 26.16,17.78 26.16,19.81 U$3.P$9_0V
  Bottom 0.813: U$28.P$2 8.76,8.76
  pour Bottom (isolate 0.305): 1.27,11.43 1.27,1.27 46.99,1.27 46.99,5.08 40.64,5.08 39.37,6.35 39.37,20.32 40.26,21.08 40.26,27.94 33.02,27.94 31.75,26.67 26.67,26.67 25.4,25.4 25.4,20.32 21.59,16.51 13.97,16.51 8.89,11.43
  pour Bottom (isolate 0.305): 17.78,52.07 17.78,46.99 25.4,46.99 25.4,38.1 30.48,33.02 30.48,30.48 31.75,30.48 33.02,29.21 43.81,29.21 49.02,24.13 67.31,24.13 67.31,50.8 arc90 66.04,52.07
I2C_RES  (via drill 0.38)
  Top 0.406: U$1.11 DPINS_2ND.7 32.51,46.48 v22.99,46.48
  Bottom 0.406: I2C_HEADER.3 17.02,45.09 18.41,46.48 v22.99,46.48
IOREF
  Top 0.406: U$1.IOREF1 PWR_PINS.7
LED_GREEN
  Top 0.254: LED1.A DPINS_1ST.4
  Top 0.406: U$1.4 DPINS_1ST.4
LED_RED
  Top 0.254: LED2.A DPINS_1ST.5
  Top 0.406: U$1.3 DPINS_1ST.5
MISO  (via drill 0.38)
  Top 0.254: v41.91,33.02 30.48,33.02 20.95,23.5 15.24,23.5 13.2,25.54 U$11.7
  Top 0.406: v48.39,33.02 60.96,33.02 U$1.MISO_SPI
  Bottom 0.254: v41.91,33.02 v48.39,33.02
MOSI  (via drill 0.38)
  Top 0.254: v41.91,30.73 30.23,30.73 22.1,22.48 15.49,22.48 14.15,21.14 U$11.3
  Top 0.406: v48.39,30.73 55.63,30.73 62.61,23.75 66.29,23.75 67.44,24.89 67.44,26.54 U$1.MOSI_SPI
  Bottom 0.254: v41.91,30.73 v48.39,30.73
N$2
  Top 0.254: JOY_Y.1 96.14,18.16 R2.2
N$3
  Top 0.406: JOY_X.6 R4.1
N$4
  Top 0.406: BEAM_Z.6 R6.1
N$5
  Top 0.254: JOY_X.1 98.55,2.03 R1.2
N$6
  Top 0.254: JOY_X.8 92.71,2.03 93.85,3.17 97.16,3.17 R1.1
N$7
  Top 0.254: JOY_Y.8 89.28,17.4 92.84,17.4 96.01,14.22 R2.1
N$8
  Top 0.406: JOY_Y.6 R5.1
N$9
  Top 0.254: BEAM_Z.1 96.39,35.69 96.52,35.56 R3.2
N$10
  Top 0.254: BEAM_Z.8 92.47,36.83 93.98,35.32 93.98,34.29 R3.1
N$11
  Top 0.254: 82.31,9.65 R7.2
  Top 0.406: R4.2 82.31,9.65 | R7.2 80.03,9.64 AMP.2
  Bottom 0.254: C11.2 79.75,9.92 AMP.2
N$21
  Top 0.254: R5.2 84.45,21.59 | 82.19,20.7 R8.2
  Top 0.406: 84.45,21.59 83.57,20.7 82.19,20.7 | AMP.6 81.52,20.07 R8.2
  Bottom 0.254: C12.2 79.39,20.44 AMP.6
N$25
  Top 0.254: 72.26,19.94 AMP.9
  Top 0.406: R6.2 80.64,43.43 78.87,43.43 78.11,42.67 78.11,31.75 77.34,30.99 77.34,25.91 75.69,24.26 75.69,20.57 75.06,19.94 72.26,19.94 | AMP.9 69.1,20.07 R9.2
  Bottom 0.254: C13.2 72.38,20.31 AMP.9
N$28
  Top 0.254: 38.52,19.05 IND-.P$2
  Top 0.406: U$3.P$10_-VOUT 38.52,19.05
N$29
  Top 0.254: 38.7,22.61 IND+.P$2
  Top 0.406: U$3.P$8_VOUT 34.04,24.13 35.56,22.61 38.7,22.61
N$30
  Top 0.254: U$11.8 13.11,26.64 15.11,24.64 18.18,24.64 R10.1
N$31
  Top 0.254: BEAM.2 99.06,46.1
  Top 0.406: 99.06,46.1 97.79,44.83 97.79,43.31 96.9,42.42 96.9,41.02 BEAM_Z.2
N$32
  Top 0.406: BEAM.1 96.9,46.74 96.9,43.56 BEAM_Z.3
N$33
  Top 0.254: R11.1 15.24,21.34 12.84,18.94 U$11.1
N$35
  Top 0.406: DEBUG.1 U$1.GND_DEBUG
N$36
  Top 0.254: LED1.C R13.1
N$37
  Top 0.254: LED2.C R12.1
N$38
  Top 0.406: DEBUG.2 U$1.SWCLK_DEBUG
N$39
  Top 0.406: DEBUG.3 U$1.SWDIO_DEBUG
N$40
  Top 0.406: DEBUG.4 U$1.RESET_DEBUG
REF_BEAM
  Top 0.406: REF.9 REF.8 74.42,44.45 BEAM_Z.5
REF_JOYX
  Top 0.254: JOY_Y.5 87.38,26.67
  Top 0.406: 87.38,26.67 82.04,32 82.04,37.34 REF.6 REF.7
REF_JOYY
  Top 0.254: REF.1 REF.2
  Bottom 0.406: JOY_X.5 87.63,11.94 85.85,13.72 85.85,15.24 82.17,18.92 82.17,24.51 REF.1
RESET  (via drill 0.38)
  Top 0.203: v7.24,51.44 9.65,51.44 RESET.P$1
  Top 0.406: U$1.RESET PWR_PINS.6
  Bottom 0.203: 6.48,46.48 6.48,50.67 v7.24,51.44 | 1.02,6.6 2.92,4.7 13.84,4.7 18.03,0.64 31.11,0.64
  Bottom 0.254: 1.02,6.6 1.02,43.43 3.3,45.72 5.71,45.72 6.48,46.48 | 31.11,0.64 U$1.RESET
SCL1  (via drill 0.38 pad 0.3)
  Top 0.254: R14.1 v19.05,40.64 | IC6.16 1.91,43.31 3.81,45.21 19.05,45.21 19.56,45.72
  Top 0.406: U$1.SCL1 DPINS_2ND.1 19.56,47.75 19.56,45.72 I2C_HEADER.2
  Bottom 0.254: I2C_HEADER.2 19.56,41.15 v19.05,40.64
SCLK  (via drill 0.38)
  Top 0.254: v41.91,31.75 30.23,31.75 21.46,22.99 14.61,22.99 14.25,23.34 U$11.5
  Top 0.406: v48.39,31.75 59.69,31.75 U$1.SCK_SPI
  Bottom 0.254: v41.91,31.75 v48.39,31.75
SDA1
  Top 0.254: IC6.15 3.17,43.81 4.06,44.7 18.03,44.7 18.29,44.45 18.29,42.42 | R15.1 22.59,42.56
  Top 0.406: U$1.SDA1 DPINS_2ND.2 22.1,47.75 I2C_HEADER.1 | 18.29,42.42 18.8,41.91 20.95,41.91 I2C_HEADER.1 | 22.59,42.56 I2C_HEADER.1
VBAT  (via drill 0.38, 0.38 pad 0.81)
  Top 0.254: v3.94,43.18 3.94,42.42 4.45,41.91 IC6.14 4.45,38.73 3.43,37.72 v3.43,33.53
  Bottom 0.254: U$12.P$1 v3.94,43.18 | U$12.P$2 6.35,30.61 v3.43,33.53
VIN  (via drill 0.38 pad 1.02)
  Top 0.254: 23.04,5.97 U$2.P$3_COMMON
  Top 0.406: PWR_PINS.1 U$1.VIN1 43.69,0.64 25.27,0.64 22.97,2.94 U$2.P$3_COMMON
  Top 0.61: v25.15,5.97 23.04,5.97
  Bottom 0.61: U$3.P$14_VIN v25.15,5.97
VNEG  (4 unrouted)
  Top 0.61: REF.11 71.5,34.54 69.22,36.83
VRAW
  Top 0.254: U$2.P$2 20.97,6.71
  Top 0.61: 20.97,6.71 20.07,7.87 15.49,7.87
  Top 0.813: 15.49,7.87 U$28.P$1
XOUT+
  Top 0.254: JOYSTICK.2 99.06,14.73
  Top 0.406: 99.06,14.73 97.66,13.34 97.66,9.53 JOY_X.3
XOUT-
  Top 0.406: JOYSTICK.1 99.06,8.38 JOY_X.2
YOUT+
  Top 0.406: JOYSTICK.4 97.54,21.34 97.54,22.61 96.01,24.13 JOY_Y.3
YOUT-
  Top 0.254: JOYSTICK.3 99.06,17.65
  Top 0.406: 99.06,17.65 97.16,19.56 97.16,20.57 96.14,21.59 JOY_Y.2

### Text on the board
tPlace: LM324N | LM324N
tNames: 9 | 8 | 7 | 6 | 5 | 4 | 3 | 2 | 1 | 0 | BEAM / Vref ADJ | + | SCL1 | output | GND | 13 | 12 | 11 | 10 | 9 | 8 | 7 | 6 | 5 | TX0> | RX0< | - | 3V3 | GND | RES | SCL1 | SDA1 | +5V | -5V | Reference / Voltage Buffer | GND | Limpet force meter Rev B | SWDIO | RESET | SWCLK | Designed by Felicia King / 2015 | JOY Y / Vref ADJ | MISO | 5V | With additional poor design / choices by Luke Miller | SCK | MOSI | RESET | -5V | 3.6V Zener Diodes | +5V | microSD | + | - | Yout | DC-DC 5V Dual Supply | MEV1D1205DC | 2nd STAGE AMP | JOY X / Vref ADJ | + | Xout | - | A0 | A1 | A2 | A3 | A6 | A7 | GND | A7 | 3V3 | Vin | TMP102 | OFF | ON | 3V3 | 5V | GND | GND | Vin
bNames: CR1220 | GND | +